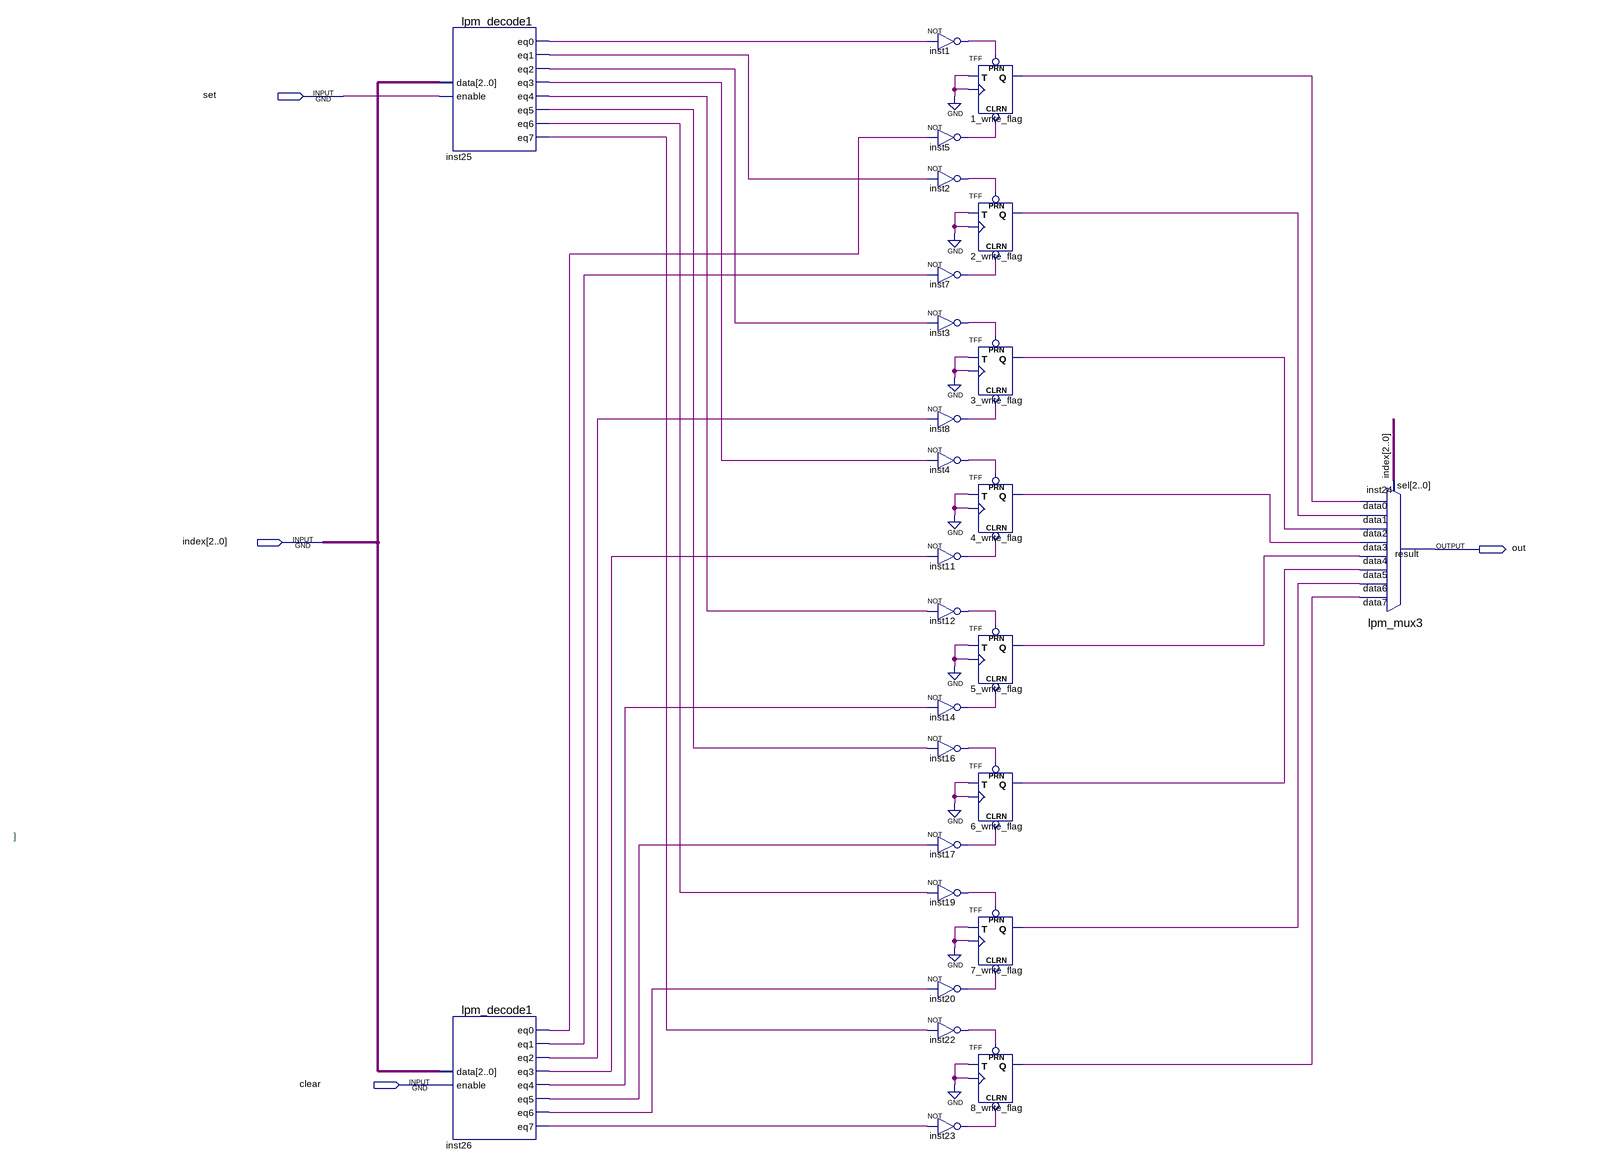
[diagram p0: schematic sheet]
// Quartus schematic write_flags.bdf as structural Verilog: 27 symbols, 4 pins
module write_flags (
  input  set,
  input  [2:0] index,
  input  clear,
  output out
);

  wire inst1_out, inst2_out, inst3_out, inst4_out, inst5_out, inst7_out, inst8_out, inst11_out, inst12_out,
       inst14_out, inst16_out, inst17_out, inst19_out, inst20_out, inst22_out, inst23_out, inst25_eq0,
       inst25_eq1, inst25_eq2, inst25_eq3, inst25_eq4, inst25_eq5, inst25_eq6, inst25_eq7, inst26_eq0,
       inst26_eq1, inst26_eq2, inst26_eq3, inst26_eq4, inst26_eq5, inst26_eq6, inst26_eq7, n1_write_flag_q,
       n2_write_flag_q, n3_write_flag_q, n4_write_flag_q, n5_write_flag_q, n6_write_flag_q, n7_write_flag_q,
       n8_write_flag_q;

  lpm_decode1 inst25 (
    .data(index), .enable(set), .eq0(inst25_eq0), .eq1(inst25_eq1), .eq2(inst25_eq2), .eq3(inst25_eq3),
    .eq4(inst25_eq4), .eq5(inst25_eq5), .eq6(inst25_eq6), .eq7(inst25_eq7));
  lpm_decode1 inst26 (
    .data(index), .enable(clear), .eq0(inst26_eq0), .eq1(inst26_eq1), .eq2(inst26_eq2), .eq3(inst26_eq3),
    .eq4(inst26_eq4), .eq5(inst26_eq5), .eq6(inst26_eq6), .eq7(inst26_eq7));
  not inst1 (inst1_out, inst25_eq0);
  TFF u_1_write_flag (.PRN(inst1_out), .CLRN(inst5_out), .T(1'b0), .CLK(1'b0), .Q(n1_write_flag_q));
  not inst5 (inst5_out, inst26_eq0);
  not inst2 (inst2_out, inst25_eq1);
  TFF u_2_write_flag (.PRN(inst2_out), .CLRN(inst7_out), .T(1'b0), .CLK(1'b0), .Q(n2_write_flag_q));
  not inst7 (inst7_out, inst26_eq1);
  not inst3 (inst3_out, inst25_eq2);
  TFF u_3_write_flag (.PRN(inst3_out), .CLRN(inst8_out), .T(1'b0), .CLK(1'b0), .Q(n3_write_flag_q));
  not inst8 (inst8_out, inst26_eq2);
  not inst4 (inst4_out, inst25_eq3);
  TFF u_4_write_flag (.PRN(inst4_out), .CLRN(inst11_out), .T(1'b0), .CLK(1'b0), .Q(n4_write_flag_q));
  not inst11 (inst11_out, inst26_eq3);
  not inst12 (inst12_out, inst25_eq4);
  TFF u_5_write_flag (.PRN(inst12_out), .CLRN(inst14_out), .T(1'b0), .CLK(1'b0), .Q(n5_write_flag_q));
  not inst14 (inst14_out, inst26_eq4);
  not inst16 (inst16_out, inst25_eq5);
  TFF u_6_write_flag (.PRN(inst16_out), .CLRN(inst17_out), .T(1'b0), .CLK(1'b0), .Q(n6_write_flag_q));
  not inst17 (inst17_out, inst26_eq5);
  not inst19 (inst19_out, inst25_eq6);
  TFF u_7_write_flag (.PRN(inst19_out), .CLRN(inst20_out), .T(1'b0), .CLK(1'b0), .Q(n7_write_flag_q));
  not inst20 (inst20_out, inst26_eq6);
  not inst22 (inst22_out, inst25_eq7);
  TFF u_8_write_flag (.PRN(inst22_out), .CLRN(inst23_out), .T(1'b0), .CLK(1'b0), .Q(n8_write_flag_q));
  not inst23 (inst23_out, inst26_eq7);
  lpm_mux3 inst24 (
    .data7(n8_write_flag_q), .data6(n7_write_flag_q), .data5(n6_write_flag_q), .data4(n5_write_flag_q),
    .data3(n4_write_flag_q), .data2(n3_write_flag_q), .data1(n2_write_flag_q), .data0(n1_write_flag_q),
    .sel(index), .result(out));

  // Notes on the sheet:
  //   ]
endmodule
